# Altium schematic sheet RK3399_EMMC_ADC_PCIE.SchDoc
size A4; Date: 07.08.2025; CheckedBy: Own Check; CompanyName: No Company; DocumentNumber: ELK.PCB.0005.0005.A.A; Revision: V0.0.1; SheetNumber: 11; SheetTotal: 22
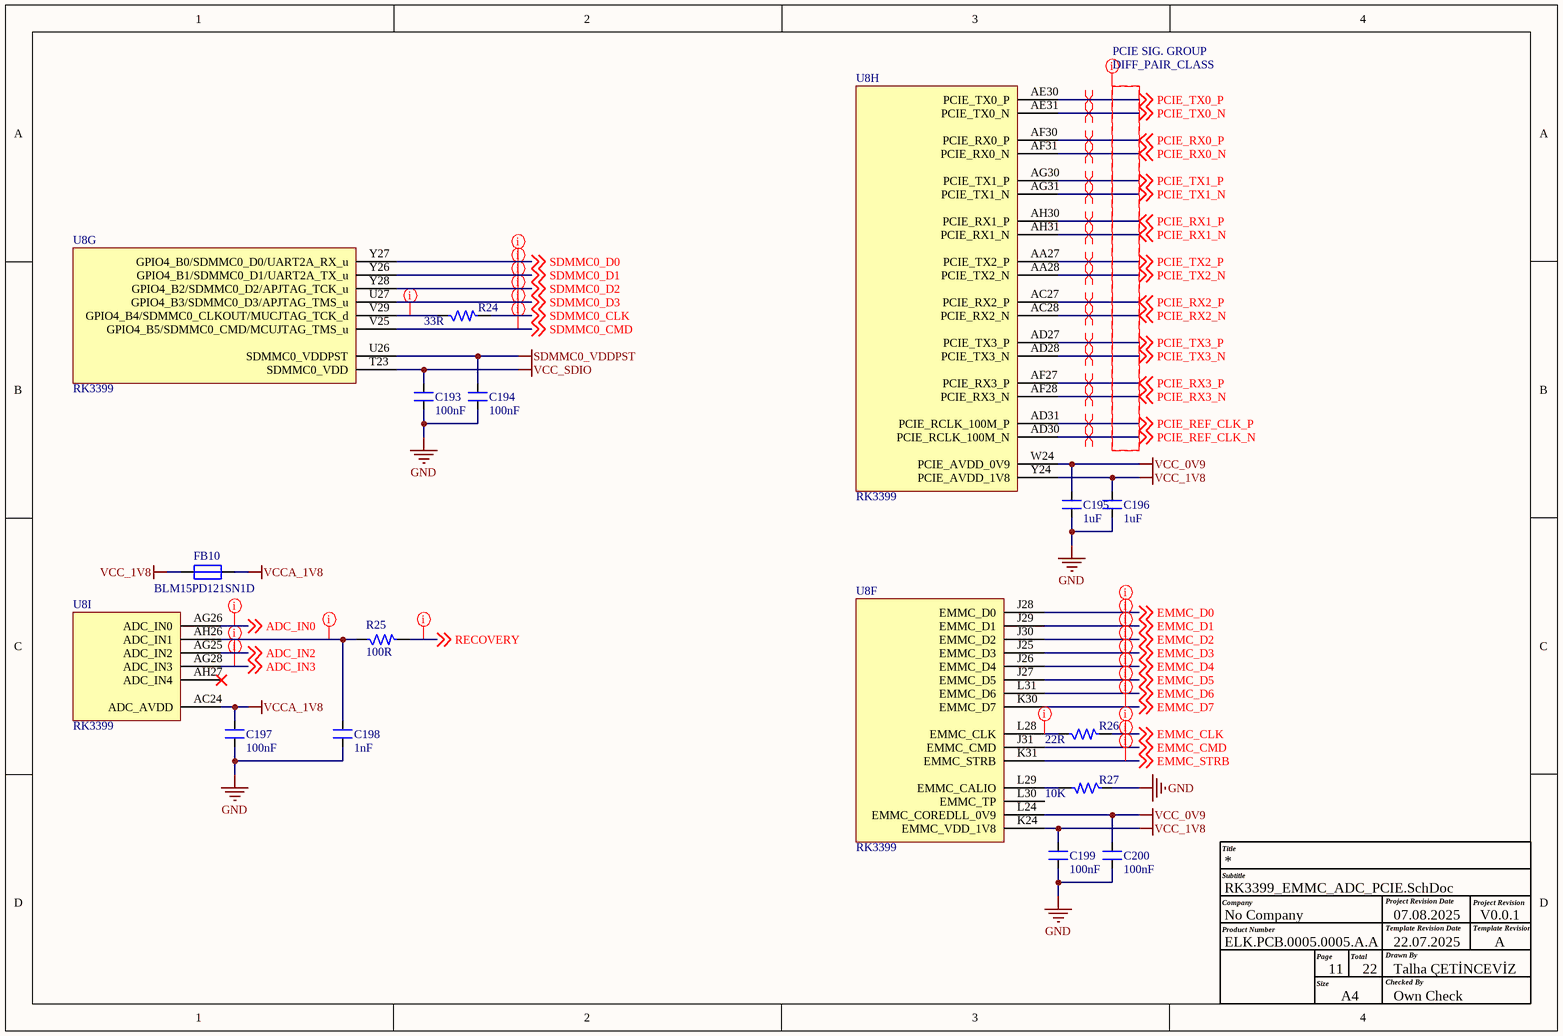
[diagram p0: RK3399_EMMC_ADC_PCIE.SchDoc]

## Parts
C193  100nF  [CAP_0201]
C194  100nF  [CAP_0201]
C195  1uF  [CAP_0201]
C196  1uF  [CAP_0201]
C197  100nF  [CAP_0201]
C198  1nF  [CAP_0201]
C199  100nF  [CAP_0201]
C200  100nF  [CAP_0201]
FB10  BLM15PD121SN1D  [RES_0402]
R24  33R  [RES_0201]
R25  100R  [RES_0201]
R26  22R  [RES_0201]
R27  10K  [RES_0201]
U8  RK3399  [FBGA828_23_826X826]  (parts F,G,H,I of 24)

## Nets
GND: C193.1 C194.1 C195.1 C196.1 C197.1 C198.1 C199.1 C200.1 R27.1
SDMMC0_VDDPST: C194.2 U8.U26(SDMMC0_VDDPST)
VCC_0V9: C195.2 C200.2 U8.L24(EMMC_COREDLL_0V9) U8.W24(PCIE_AVDD_0V9)
VCC_1V8: C196.2 C199.2 FB10.1 U8.K24(EMMC_VDD_1V8) U8.Y24(PCIE_AVDD_1V8)
VCC_SDIO: C193.2 U8.T23(SDMMC0_VDD)
VCCA_1V8: C197.2 FB10.2 U8.AC24(ADC_AVDD)
ADC_IN0: U8.AG26(ADC_IN0) ; off-sheet ADC_IN0
ADC_IN2: U8.AG25(ADC_IN2) ; off-sheet ADC_IN2
ADC_IN3: U8.AG28(ADC_IN3) ; off-sheet ADC_IN3
EMMC_CLK: R26.2 ; off-sheet EMMC_CLK
EMMC_CMD: U8.J31(EMMC_CMD) ; off-sheet EMMC_CMD
EMMC_D0: U8.J28(EMMC_D0) ; off-sheet EMMC_D0
EMMC_D1: U8.J29(EMMC_D1) ; off-sheet EMMC_D1
EMMC_D2: U8.J30(EMMC_D2) ; off-sheet EMMC_D2
EMMC_D3: U8.J25(EMMC_D3) ; off-sheet EMMC_D3
EMMC_D4: U8.J26(EMMC_D4) ; off-sheet EMMC_D4
EMMC_D5: U8.J27(EMMC_D5) ; off-sheet EMMC_D5
EMMC_D6: U8.L31(EMMC_D6) ; off-sheet EMMC_D6
EMMC_D7: U8.K30(EMMC_D7) ; off-sheet EMMC_D7
EMMC_STRB: U8.K31(EMMC_STRB) ; off-sheet EMMC_STRB
PCIE_REF_CLK_N: U8.AD30(PCIE_RCLK_100M_N) ; off-sheet PCIE_REF_CLK_N
PCIE_REF_CLK_P: U8.AD31(PCIE_RCLK_100M_P) ; off-sheet PCIE_REF_CLK_P
PCIE_RX0_N: U8.AF31(PCIE_RX0_N) ; off-sheet PCIE_RX0_N
PCIE_RX0_P: U8.AF30(PCIE_RX0_P) ; off-sheet PCIE_RX0_P
PCIE_RX1_N: U8.AH31(PCIE_RX1_N) ; off-sheet PCIE_RX1_N
PCIE_RX1_P: U8.AH30(PCIE_RX1_P) ; off-sheet PCIE_RX1_P
PCIE_RX2_N: U8.AC28(PCIE_RX2_N) ; off-sheet PCIE_RX2_N
PCIE_RX2_P: U8.AC27(PCIE_RX2_P) ; off-sheet PCIE_RX2_P
PCIE_RX3_N: U8.AF28(PCIE_RX3_N) ; off-sheet PCIE_RX3_N
PCIE_RX3_P: U8.AF27(PCIE_RX3_P) ; off-sheet PCIE_RX3_P
PCIE_TX0_N: U8.AE31(PCIE_TX0_N) ; off-sheet PCIE_TX0_N
PCIE_TX0_P: U8.AE30(PCIE_TX0_P) ; off-sheet PCIE_TX0_P
PCIE_TX1_N: U8.AG31(PCIE_TX1_N) ; off-sheet PCIE_TX1_N
PCIE_TX1_P: U8.AG30(PCIE_TX1_P) ; off-sheet PCIE_TX1_P
PCIE_TX2_N: U8.AA28(PCIE_TX2_N) ; off-sheet PCIE_TX2_N
PCIE_TX2_P: U8.AA27(PCIE_TX2_P) ; off-sheet PCIE_TX2_P
PCIE_TX3_N: U8.AD28(PCIE_TX3_N) ; off-sheet PCIE_TX3_N
PCIE_TX3_P: U8.AD27(PCIE_TX3_P) ; off-sheet PCIE_TX3_P
RECOVERY: R25.2 ; off-sheet RECOVERY
SDMMC0_CLK: R24.2 ; off-sheet SDMMC0_CLK
SDMMC0_CMD: U8.V25(GPIO4_B5/SDMMC0_CMD/MCUJTAG_TMS_u) ; off-sheet SDMMC0_CMD
SDMMC0_D0: U8.Y27(GPIO4_B0/SDMMC0_D0/UART2A_RX_u) ; off-sheet SDMMC0_D0
SDMMC0_D1: U8.Y26(GPIO4_B1/SDMMC0_D1/UART2A_TX_u) ; off-sheet SDMMC0_D1
SDMMC0_D2: U8.Y28(GPIO4_B2/SDMMC0_D2/APJTAG_TCK_u) ; off-sheet SDMMC0_D2
SDMMC0_D3: U8.U27(GPIO4_B3/SDMMC0_D3/APJTAG_TMS_u) ; off-sheet SDMMC0_D3
NetC198_2: C198.2 R25.1 U8.AH26(ADC_IN1)
NetR24_1: R24.1 U8.V29(GPIO4_B4/SDMMC0_CLKOUT/MUCJTAG_TCK_d)
NetR26_1: R26.1 U8.L28(EMMC_CLK)
NetR27_2: R27.2 U8.L29(EMMC_CALIO)

Not connected (* = marked no-connect by the designer): U8 AH27(ADC_IN4)* L30(EMMC_TP)

## Layout directives
net class ADC SIG. GROUP: ADC_IN0, ADC_IN2, ADC_IN3, NetC198_2, RECOVERY
net class 50OHM_SDMMC: NetR24_1, SDMMC0_CLK, SDMMC0_CMD, SDMMC0_D0, SDMMC0_D1, SDMMC0_D2, SDMMC0_D3
net class PCIE SIG. GROUP; net class DIFF_PAIR_CLASS: PCIE_REF_CLK_N, PCIE_REF_CLK_P, PCIE_RX0_N, PCIE_RX0_P, PCIE_RX1_N, PCIE_RX1_P, PCIE_RX2_N, PCIE_RX2_P, PCIE_RX3_N, PCIE_RX3_P, PCIE_TX0_N, PCIE_TX0_P, PCIE_TX1_N, PCIE_TX1_P, PCIE_TX2_N, PCIE_TX2_P, PCIE_TX3_N, PCIE_TX3_P
differential pair; differential pair class DIFF100_PCIE: PCIE_REF_CLK_N, PCIE_REF_CLK_P, PCIE_RX0_N, PCIE_RX0_P, PCIE_RX1_N, PCIE_RX1_P, PCIE_RX2_N, PCIE_RX2_P, PCIE_RX3_N, PCIE_RX3_P, PCIE_TX0_N, PCIE_TX0_P, PCIE_TX1_N, PCIE_TX1_P, PCIE_TX2_N, PCIE_TX2_P, PCIE_TX3_N, PCIE_TX3_P
net class 50OHM_EMMC: EMMC_CLK, EMMC_CMD, EMMC_D0, EMMC_D1, EMMC_D2, EMMC_D3, EMMC_D4, EMMC_D5, EMMC_D6, EMMC_D7, EMMC_STRB, NetR26_1

## Notes on the sheet
- Title
- Company
- Product Number
- Subtitle
- Project Revision Date
- Template Revision Date
- Project Revision
- Template Revision
- Size
- Page
- A4
- Total
- Checked By
- Drawn By
- 22.07.2025
- Talha ÇETİNCEVİZ
- A

## Library data of the parts
C193 C194 C197 C199 C200 = CAP_100nF-25V-10%-0201: 0.1µF ±10% 25V Ceramic Capacitor X5R 0201 (0603 Metric); Manufacturer: TDK Corporation; Manufacturer Part Number: C0603X5R1E104K030BB; Case/Package: 0201; Supplier-1: Digikey
C195 C196 = CAP_1uF-16V-10%-0201: 1µF ±20% 16V Ceramic Capacitor X5R 0201 (0603 Metric); Manufacturer: Samsung Electro-Mechanics; Manufacturer Part Number: CL03A105MO3NRNH; Case/Package: 0201; Supplier-1: Digikey
C198 = CAP_1nF-16V-10%-0201: 1000pF ±10% 16V Ceramic Capacitor X7R 0201 (0603 Metric); Manufacturer: Murata Electronics; Manufacturer Part Number: GRM033R71C102KA01D; Case/Package: 0201; Supplier-1: Digikey
FB10 = FB_120R-1.3A-100Mhz-0402: 120 Ohms @ 100MHz 1 Power Line Ferrite Bead 0402 (1005 Metric) 1.3A 90mOhm; Manufacturer: Murata Electronics; Mnaufacturer Part Number: BLM15PD121SN1D; Case/Package: 0402; Supplier-1: Digikey
R24 = RES_33R-0.05W-1%-0201: 33 Ohms ±1% 0.05W, 1/20W Chip Resistor 0201 (0603 Metric) Thick Film; Manufacturer: Yageo; Manufacturer Part Number: RC0201FR-0733RL; Case/Package: 0201; Supplier-1: Digikey
R25 = RES_100R-0.05W-1%-0201: 100 kOhms ±1% 0.05W, 1/20W Chip Resistor 0201 (0603 Metric) Automotive AEC-Q200 Thick Film; Manufacturer: Panasonic Electronic Components; Manufacturer Part Number: ERJ-1GNF1003C; Case/Package: 0201; Supplier-1: Digikey
R26 = RES_22R-0.05W-1%-0201: 22 Ohms ±1% 0.05W, 1/20W Chip Resistor 0201 (0603 Metric) Moisture Resistant Thick Film; Manufacturer: Yageo; Manufacturer Part Number: RC0201FR-0722RL; Case/Package: 0201; Supplier-1: Digikey
R27 = RES_10K-0.05W-1%-0201: 10 kOhms ±1% 0.05W, 1/20W Chip Resistor 0201 (0603 Metric) Thick Film; Manufacturer: Stackpole Electronics Inc; Manufacturer Part Number: RMCF0201FT10K0; Case/Package: 0201; Supplier-1: Digikey
U8 = IC_RK3399-FCBGA828: RK3399 is a low power, high performance processor for computing, personal mobile.; Manufacturer: Rockchip; Manufacturer Part Number: RK3399; Case/Package: FCBGA828; Supplier-1: Rockchip